# Altium project PCB_Project1.PrjPCB
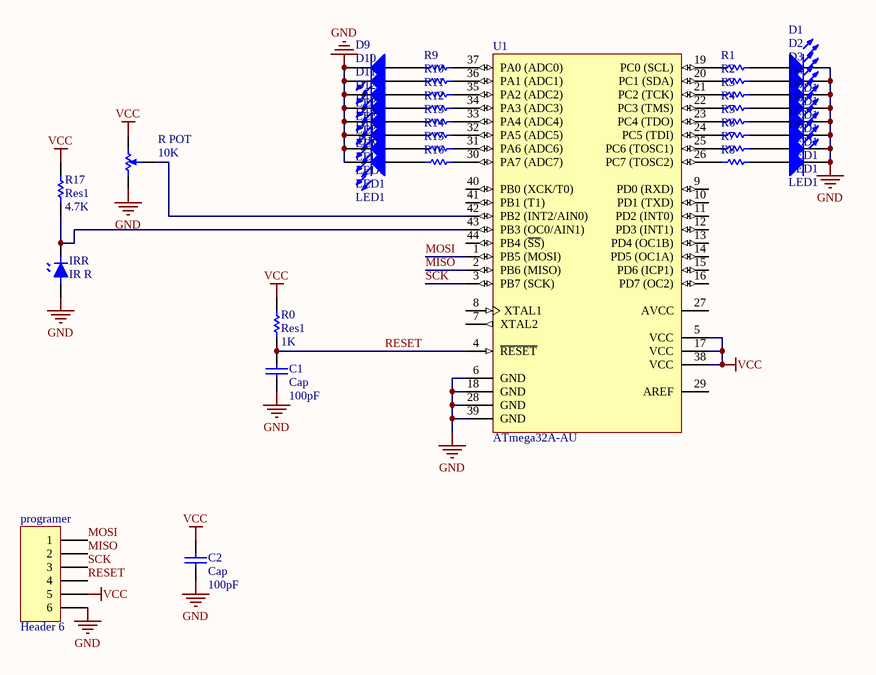
[diagram p0: Sheet1.SchDoc]
1 sheet, 40 parts. Net scope: global (net labels, ports and power ports of the same name join across sheets).
Board file: PCB3.PcbDoc

## Sheet Sheet1.SchDoc
size A4

### Parts
C1  Cap  value 100pF  [PIN2]
C2  Cap  value 100pF  [PIN2]
D1  LED1  [LED-1]
D2  LED1  [LED-1]
D3  LED1  [LED-1]
D4  LED1  [LED-1]
D5  LED1  [LED-1]
D6  LED1  [LED-1]
D7  LED1  [LED-1]
D8  LED1  [LED-1]
D9  LED1  [LED-1]
D10  LED1  [LED-1]
D11  LED1  [LED-1]
D12  LED1  [LED-1]
D13  LED1  [LED-1]
D14  LED1  [LED-1]
D15  LED1  [LED-1]
D16  LED1  [LED-1]
IRR  IR R  [LED-3MM]
programer  Header 6  [HDR1X6]
R0  Res1  value 1K  [AXIAL-0.3]
R1  Res1  [C1206]  (value not drawn)
R2  Res1  [C1206]  (value not drawn)
R3  Res1  [C1206]  (value not drawn)
R4  Res1  [C1206]  (value not drawn)
R5  Res1  [C1206]  (value not drawn)
R6  Res1  [C1206]  (value not drawn)
R7  Res1  [C1206]  (value not drawn)
R8  Res1  [C1206]  (value not drawn)
R9  Res1  [C1206]  (value not drawn)
R10  Res1  [C1206]  (value not drawn)
R11  Res1  [C1206]  (value not drawn)
R12  Res1  [C1206]  (value not drawn)
R13  Res1  [C1206]  (value not drawn)
R14  Res1  [C1206]  (value not drawn)
R15  Res1  [C1206]  (value not drawn)
R16  Res1  [C1206]  (value not drawn)
R17  Res1  value 4.7K  [AXIAL-0.3]
R_POT  10K  [POT4MM-2]
U1  ATmega32A-AU  [44A_N]

### Nets
GND: C1.1 C2.1 D1.2(K) D2.2(K) D3.2(K) D4.2(K) D5.2(K) D6.2(K) D7.2(K) D8.2(K) D9.2(K) D10.2(K) D11.2(K) D12.2(K) D13.2(K) D14.2(K) D15.2(K) D16.2(K) IRR.A programer.6 R_POT.CCW(-) U1.6(GND) U1.18(GND) U1.28(GND) U1.39(GND)
VCC: C2.2 programer.5 R0.2 R17.2 R_POT.CW(+) U1.5(VCC) U1.17(VCC) U1.38(VCC)
MISO: programer.2 U1.2(PB6_(MISO))
MOSI: programer.1 U1.1(PB5_(MOSI))
RESET: C1.2 programer.4 R0.1 U1.4(~{RESET})
SCK: programer.3 U1.3(PB7_(SCK))
NetD1_1: D1.1(A) R1.2
NetD2_1: D2.1(A) R2.2
NetD3_1: D3.1(A) R3.2
NetD4_1: D4.1(A) R4.2
NetD5_1: D5.1(A) R5.2
NetD6_1: D6.1(A) R6.2
NetD7_1: D7.1(A) R7.2
NetD8_1: D8.1(A) R8.2
NetD9_1: D9.1(A) R9.2
NetD10_1: D10.1(A) R10.2
NetD11_1: D11.1(A) R11.2
NetD12_1: D12.1(A) R12.2
NetD13_1: D13.1(A) R13.2
NetD14_1: D14.1(A) R14.2
NetD15_1: D15.1(A) R15.2
NetD16_1: D16.1(A) R16.2
NetIRR_K: IRR.K R17.1 U1.43(PB3_(OC0/AIN1))
NetR1_1: R1.1 U1.19(PC0_(SCL))
NetR2_1: R2.1 U1.20(PC1_(SDA))
NetR3_1: R3.1 U1.21(PC2_(TCK))
NetR4_1: R4.1 U1.22(PC3_(TMS))
NetR5_1: R5.1 U1.23(PC4_(TDO))
NetR6_1: R6.1 U1.24(PC5_(TDI))
NetR7_1: R7.1 U1.25(PC6_(TOSC1))
NetR8_1: R8.1 U1.26(PC7_(TOSC2))
NetR9_1: R9.1 U1.37(PA0_(ADC0))
NetR10_1: R10.1 U1.36(PA1_(ADC1))
NetR11_1: R11.1 U1.35(PA2_(ADC2))
NetR12_1: R12.1 U1.34(PA3_(ADC3))
NetR13_1: R13.1 U1.33(PA4_(ADC4))
NetR14_1: R14.1 U1.32(PA5_(ADC5))
NetR15_1: R15.1 U1.31(PA6_(ADC6))
NetR16_1: R16.1 U1.30(PA7_(ADC7))
NetR_POT_W: R_POT.W U1.42(PB2_(INT2/AIN0))

Not connected (* = marked no-connect by the designer): U1 7(XTAL2) 8(XTAL1) 9(PD0_(RXD)) 10(PD1_(TXD)) 11(PD2_(INT0)) 12(PD3_(INT1)) 13(PD4_(OC1B)) 14(PD5_(OC1A)) 15(PD6_(ICP1)) 16(PD7_(OC2)) 27(AVCC) 29(AREF) 40(PB0_(XCK/T0)) 41(PB1_(T1)) 44(PB4_(~{SS}))

### Notes on the sheet
- Title
- Size:
- Date:
- A4
- Project Number:
- Time:
- Revision:
- Sheet
- of
- Drawn By:
- IOElectro
- File:
- Note:

### Library data of the parts
C1 C2 = Cap: Capacitor; Published: 8-Jun-2000; LatestRevisionDate: 17-Jul-2002; LatestRevisionNote: Re-released for DXP Platform.; PackageReference: RAD-0.3; Publisher: Altium Limited; PackageDescription: Radial Cap, Thru-Hole; 2 Leads; 0.3 in Pin Spacing
D1-D16 = LED2: Typical RED, GREEN, YELLOW, AMBER GaAs LED; Published: 8-Jun-2000; LatestRevisionDate: 17-Jul-2002; LatestRevisionNote: Re-released for DXP Platform.; PackageVersion: Feb-2002; PackageReference: 3.2X1.6X1.1; Publisher: Altium Limited; PackageDescription: SM LED; 2 Flat Leads
IRR = IRR: IR Receiver
programer = Header 6: Header, 6-Pin; LatestRevisionDate: 17-Jul-2002; LatestRevisionNote: Re-released for DXP Platform.; Publisher: Altium Limited
R0 R17 = Res1: Resistor; Published: 8-Jun-2000; LatestRevisionDate: 17-Jul-2002; LatestRevisionNote: Re-released for DXP Platform.; PackageReference: AXIAL-0.3; Publisher: Altium Limited; PackageDescription: Axial Device, Thru-Hole; 2 Leads; 0.3 in Pin Spacing
R1-R16 = Res1: Resistor; Value: 1K; Published: 8-Jun-2000; LatestRevisionDate: 17-Jul-2002; LatestRevisionNote: Re-released for DXP Platform.; PackageReference: AXIAL-0.3; Publisher: Altium Limited; PackageDescription: Axial Device, Thru-Hole; 2 Leads; 0.3 in Pin Spacing
R_POT = RPot SM: Square Trimming Potentiometer; Published: 17-Dec-2003; DatasheetVersion: Oct-2003; PackageReference: POT4MM-2; Publisher: Altium Limited; PackageDescription: Square Trimming Potentiometer; ComponentLink1Description: Manufacturer Link; ComponentLink1URL: http://bourns.com/2/search.html
U1 = ATmega32A-AU: 8-bit AVR Microcontroller, 32KB Flash, 1KB EEPROM, 2KB SRAM, 44-pin TQFP, Industrial Grade (-40°C to 85°C); Published: 1-Apr-2010; DatasheetVersion: revB, Jul-2009; PackageVersion: rev.B, Oct-2001; PackageReference: 44A; Publisher: Altium Limited; PackageDescription: 44-Pin Plastic Thin Profile Quad Flat Pack, 10 x 10 x 1.0 mm Body, 0.8 mm Pitch (TQFP); Supplier 1: Digi-Key; Supplier Part Number 1: ATMEGA32A-AU-ND; Supplier 2: Farnell; Supplier Part Number 2: 1704563; Supplier 3: Mouser; Supplier Part Number 3: 556-ATMEGA32A-AU; ComponentLink1Description: Manufacturer Link; ComponentLink1URL: http://www.atmel.com/products/avr/default.asp?; ComponentLink2Description: ATmega32A Datasheet; ComponentLink2URL: http://www.atmel.com/dyn/resources/prod_documents/doc8155.pdf; ComponentLink3Description: ATmega32A Summary; ComponentLink3URL: http://www.atmel.com/dyn/resources/prod_documents/8155S.pdf; ComponentLink4Description: Atmel.com Home; ComponentLink4URL: http://www.atmel.com